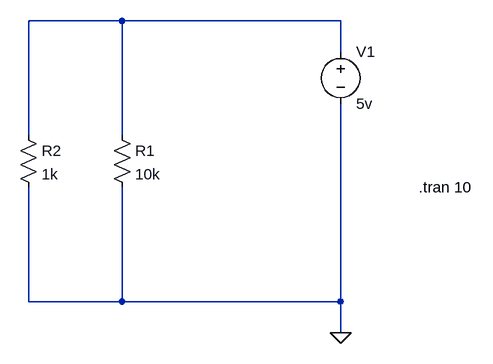
[diagram p0: schematic 37#24.5_2.(2a).(no-capacitors).asc]
37#24.5_2.(2a).(no-capacitors).asc, the LTspice schematic file:
Version 4
SHEET 1 880 680
WIRE -128 -432 -272 -432
WIRE 208 -432 -128 -432
WIRE 208 -384 208 -432
WIRE -272 -256 -272 -432
WIRE -128 -256 -128 -432
WIRE -272 0 -272 -176
WIRE -128 0 -128 -176
WIRE -128 0 -272 0
WIRE 208 0 208 -304
WIRE 208 0 -128 0
WIRE 208 48 208 0
FLAG 208 48 0
SYMBOL voltage 208 -400 R0
WINDOW 123 0 0 Left 2
WINDOW 39 0 0 Left 2
SYMATTR InstName V1
SYMATTR Value 5v
SYMBOL res -144 -272 R0
SYMATTR InstName R1
SYMATTR Value 10k
SYMBOL res -288 -272 R0
SYMATTR InstName R2
SYMATTR Value 1k
TEXT 328 -176 Left 2 !.tran 10

The netlist it stands for:
* 37#24.5_2.(2a).(no-capacitors).asc
V1 N001 0 5v
R1 N001 0 10k
R2 N001 0 1k
.tran 10
.backanno
.end